# Altium schematic sheet 04 IF AMP Block.SchDoc: <Project Name>
size A3; ApprovedBy: <Appr.>; Author: <Author>; CompanyName: Infineon Technologies AG; Engineer: <Rel.>; Organization: Infineon Technologies AG; Address1: IFAG DES S PS; Address2: Am Campeon 1-12  -  85579 Neubiberg  -  Germany; Address3: 85579 Neubiberg; Address4: Germany; Revision: <Rev.>; SheetNumber: 4; Release: RC00; PageSetup: Record=PageOptions|CenterHorizontal=True|CenterVertical=True|PrintScale=1.01|XCorrection=1.00|YCorrection=1.00|PrintKind=0|BorderSize=5000000|LeftOffset=0|BottomOffset=0|Orientation=2|PaperLength=1000|PaperWidth=1000|Scale=100|PaperSource=7|PrintQuality=-4|MediaType=1|DitherType=10|PaperKind=A3|PrintScaleMode=1; Doc_ConfidentialStatus: <Doc_ConfidentialStatus>; Doc_Preliminary: <Doc_Preliminary>
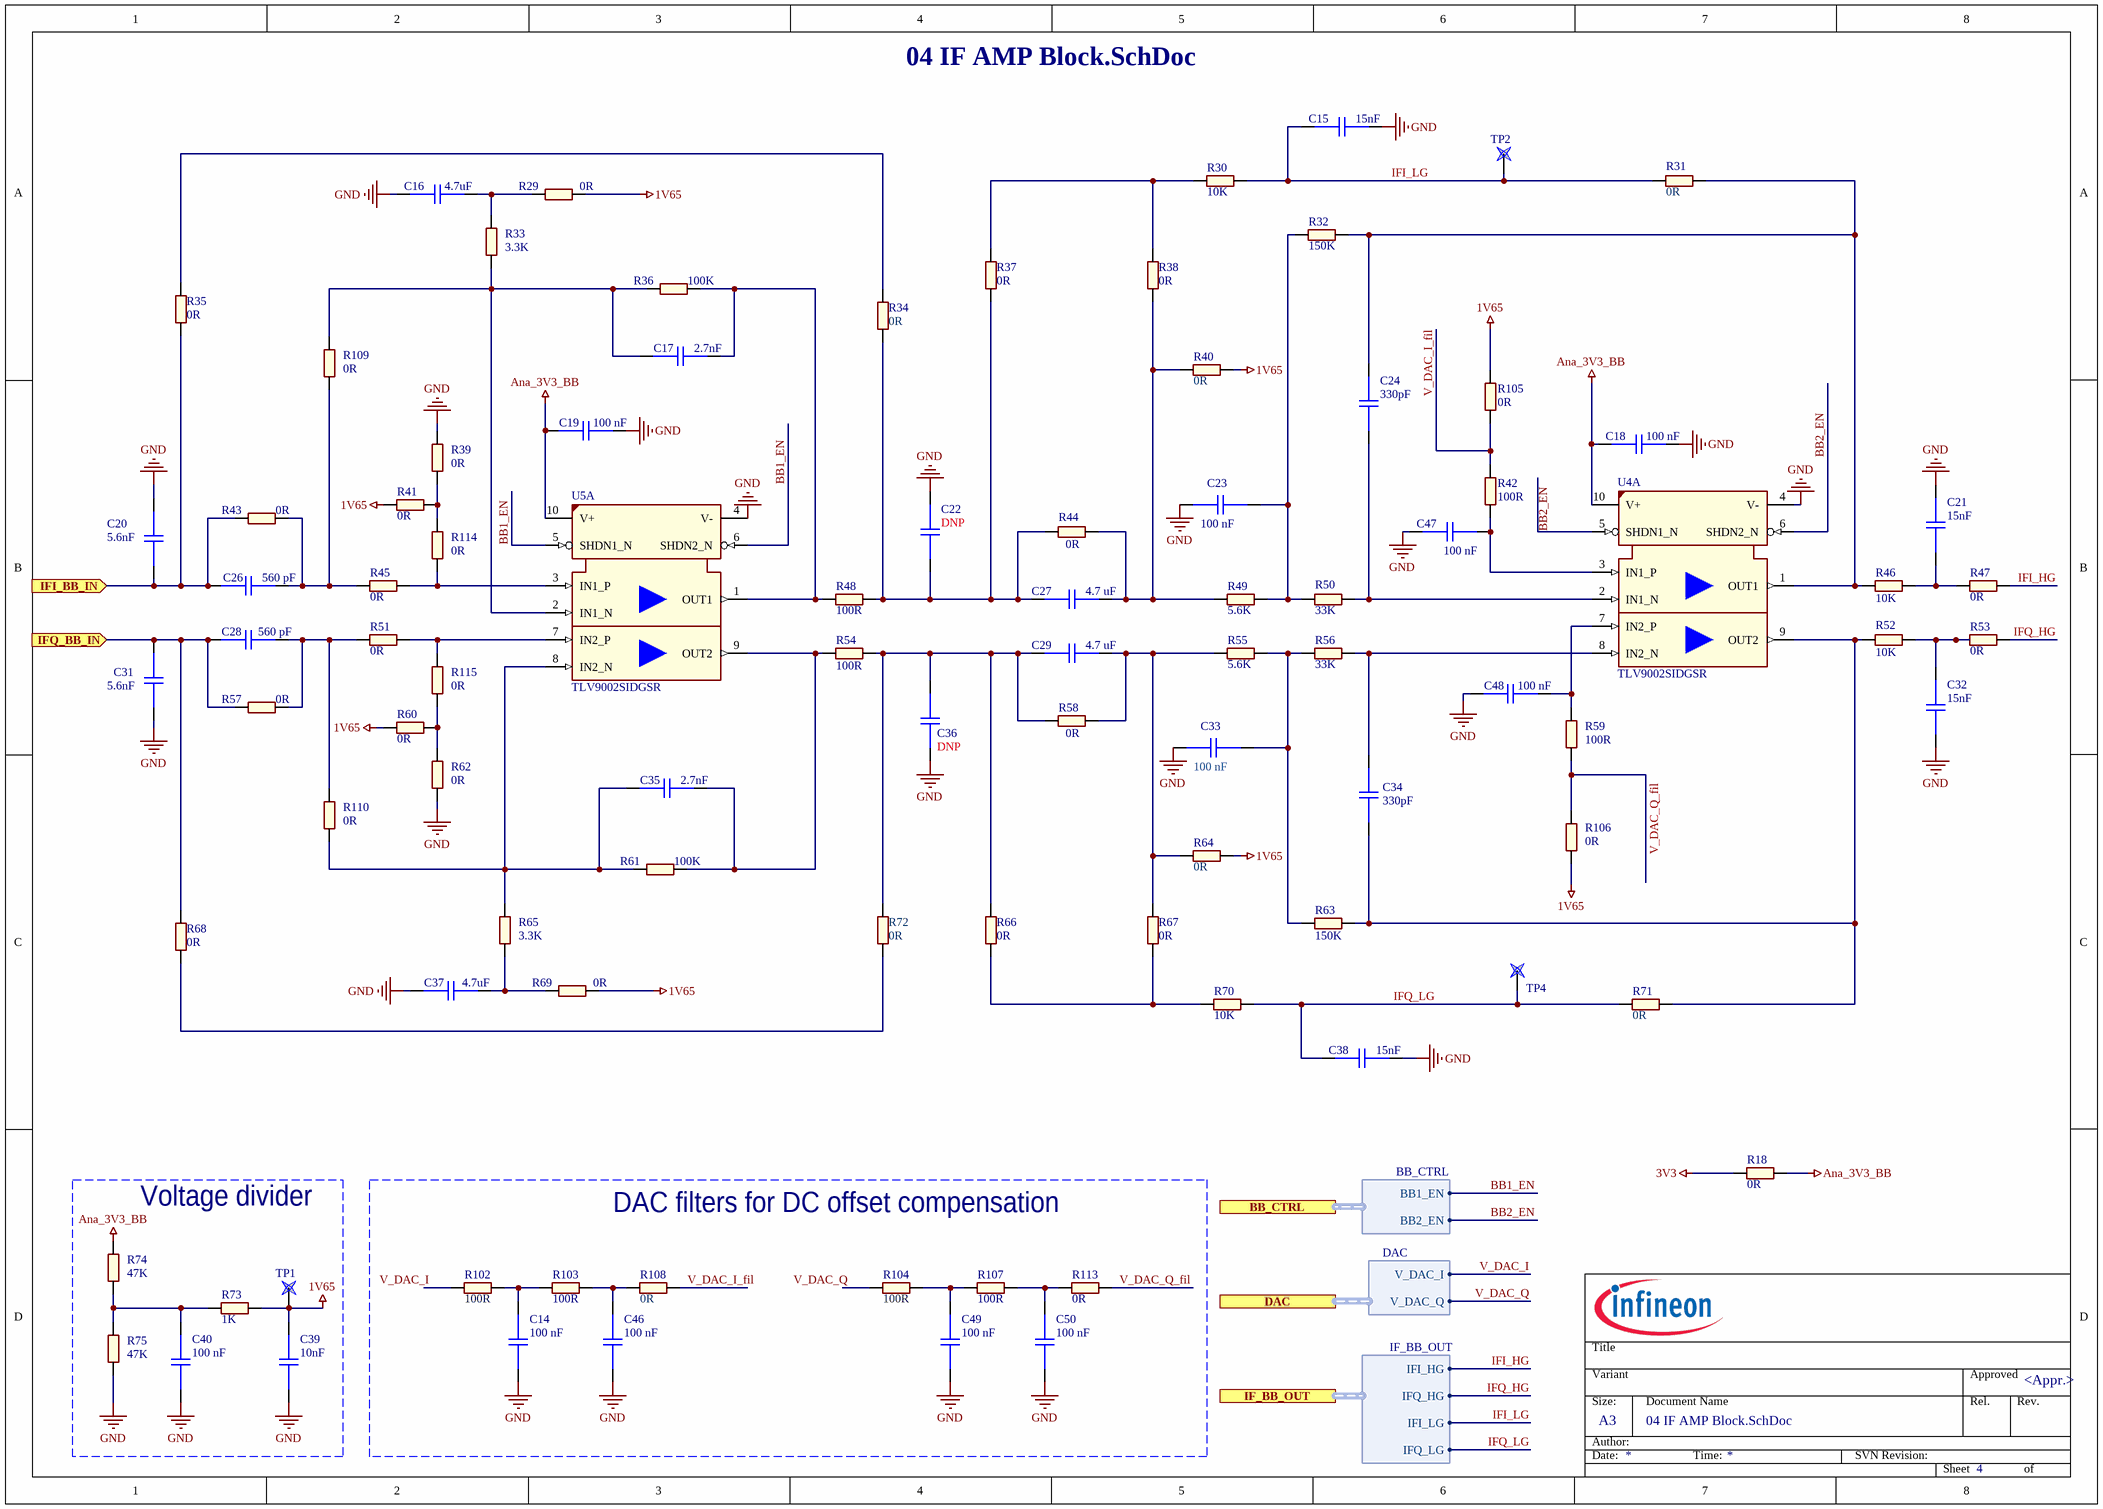
[diagram p0: 04 IF AMP Block.SchDoc]

## Parts
C14  100 nF  [CAPC1005X55N-0_2]
C15  15nF  [CAPC1005X55N-0_2]
C16  4.7uF  [CAPC1005X55N-0_2]
C17  2.7nF  [CAPC1005X55N-0_2]
C18  100 nF  [CAPC1005X55N-0_2]
C19  100 nF  [CAPC1005X55N-0_2]
C20  5.6nF  [CAPC1005X55N-0_2]
C21  15nF  [CAPC1005X55N-0_2]
C22  DNP  [CAPC1005X55N-0_2]
C23  100 nF  [CAPC1005X55N-0_2]
C24  330pF  [CAPC1005X55N-0_2]
C26  560 pF  [CAPC1005X55N-0_2]
C27  4.7 uF  [CAPC1005X55N-0_2]
C28  560 pF  [CAPC1005X55N-0_2]
C29  4.7 uF  [CAPC1005X55N-0_2]
C31  5.6nF  [CAPC1005X55N-0_2]
C32  15nF  [CAPC1005X55N-0_2]
C33  100 nF  [CAPC1005X55N-0_2]
C34  330pF  [CAPC1005X55N-0_2]
C35  2.7nF  [CAPC1005X55N-0_2]
C36  DNP  [CAPC1005X55N-0_2]
C37  4.7uF  [CAPC1005X55N-0_2]
C38  15nF  [CAPC1005X55N-0_2]
C39  10nF  [CAPC1005X55N-0_2]
C40  100 nF  [CAPC1005X55N-0_2]
C46  100 nF  [CAPC1005X55N-0_2]
C47  100 nF  [CAPC1005X55N-0_2]
C48  100 nF  [CAPC1005X55N-0_2]
C49  100 nF  [CAPC1005X55N-0_2]
C50  100 nF  [CAPC1005X55N-0_2]
R18  0R  [RESC1005X40N_2]
R29  0R  [RESC1005X40N_2]
R30  10K  [RESC1005X40N_2]
R31  0R  [RESC1005X40N_2]
R32  150K  [RESC1005X40N_2]
R33  3.3K  [RESC1005X40N_2]
R34  0R  [RESC1005X40N_2]
R35  0R  [RESC1005X40N_2]
R36  100K  [RESC1005X40N_2]
R37  0R  [RESC1005X40N_2]
R38  0R  [RESC1005X40N_2]
R39  0R  [RESC1005X40N_2]
R40  0R  [RESC1005X40N_2]
R41  0R  [RESC1005X40N_2]
R42  100R  [RESC1005X40N_2]
R43  0R  [RESC1005X40N_2]
R44  0R  [RESC1005X40N_2]
R45  0R  [RESC1005X40N_2]
R46  10K  [RESC1005X40N_2]
R47  0R  [RESC1005X40N_2]
R48  100R  [RESC1005X40N_2]
R49  5.6K  [RESC1005X40N_2]
R50  33K  [RESC1005X40N_2]
R51  0R  [RESC1005X40N_2]
R52  10K  [RESC1005X40N_2]
R53  0R  [RESC1005X40N_2]
R54  100R  [RESC1005X40N_2]
R55  5.6K  [RESC1005X40N_2]
R56  33K  [RESC1005X40N_2]
R57  0R  [RESC1005X40N_2]
R58  0R  [RESC1005X40N_2]
R59  100R  [RESC1005X40N_2]
R60  0R  [RESC1005X40N_2]
R61  100K  [RESC1005X40N_2]
R62  0R  [RESC1005X40N_2]
R63  150K  [RESC1005X40N_2]
R64  0R  [RESC1005X40N_2]
R65  3.3K  [RESC1005X40N_2]
R66  0R  [RESC1005X40N_2]
R67  0R  [RESC1005X40N_2]
R68  0R  [RESC1005X40N_2]
R69  0R  [RESC1005X40N_2]
R70  10K  [RESC1005X40N_2]
R71  0R  [RESC1005X40N_2]
R72  0R  [RESC1005X40N_2]
R73  1K  [RESC1005X40N_2]
R74  47K  [RESC1005X40N_2]
R75  47K  [RESC1005X40N_2]
R102  100R  [RESC1005X40N_2]
R103  100R  [RESC1005X40N_2]
R104  100R  [RESC1005X40N_2]
R105  0R  [RESC1005X40N_2]
R106  0R  [RESC1005X40N_2]
R107  100R  [RESC1005X40N_2]
R108  0R  [RESC1005X40N_2]
R109  0R  [RESC1005X40N_2]
R110  0R  [RESC1005X40N_2]
R113  0R  [RESC1005X40N_2]
R114  0R  [RESC1005X40N_2]
R115  0R  [RESC1005X40N_2]
TP1  Testpoint  [TP1.5MM]  (value not drawn)  (no BOM)
TP2  Testpoint  [TP1.5MM]  (value not drawn)  (no BOM)
TP4  Testpoint  [TP1.5MM]  (value not drawn)  (no BOM)
U4  TLV9002SIDGSR  [SOP50P490X110-10N-1-V]  (part A of 3)
U5  TLV9002SIDGSR  [SOP50P490X110-10N-1-V]  (part A of 3)

## Ports
BB_CTRL (harness BB_CTRL), DAC (harness DAC), IF_BB_OUT (harness IF_BB_OUT), IFI_BB_IN (in), IFQ_BB_IN (in)

## Harnesses
IF_BB_OUT: IFI_HG, IFQ_HG, IFQ_LG, IFI_LG
DAC: V_DAC_I, V_DAC_Q
BB_CTRL: BB1_EN, BB2_EN

## Nets
1V65: C39.1 R29.1 R40.1 R41.1 R60.1 R64.1 R69.1 R73.1 R105.2 R106.1 TP1.1
3V3: R18.2
Ana_3V3_BB: C18.2 C19.2 R18.1 R74.2 U4.10(V+) U5.10(V+)
GND: C14.1 C15.2 C16.1 C18.1 C19.1 C20.1 C21.1 C22.1 C23.2 C31.1 C32.2 C33.2 C36.2 C37.2 C38.1 C39.2 C40.2 C46.1 C47.2 C48.1 C49.1 C50.1 R39.2 R62.2 R75.2 U4.4(V-) U5.4(V-)
BB1_EN: U5.5(SHDN1_N) U5.6(SHDN2_N) ; port BB_CTRL.BB1_EN
BB2_EN: U4.5(SHDN1_N) U4.6(SHDN2_N) ; port BB_CTRL.BB2_EN
IFI_BB_IN: C20.2 C26.2 R35.2 R43.2 ; port IFI_BB_IN
IFI_HG: R47.1 ; port IF_BB_OUT.IFI_HG
IFI_LG: C15.1 R30.2 R31.2 TP2.1 ; port IF_BB_OUT.IFI_LG
IFQ_BB_IN: C28.2 C31.2 R57.2 R68.1 ; port IFQ_BB_IN
IFQ_HG: R53.1 ; port IF_BB_OUT.IFQ_HG
IFQ_LG: C38.2 R70.2 R71.2 TP4.1 ; port IF_BB_OUT.IFQ_LG
V_DAC_I: R102.2 ; port DAC.V_DAC_I
V_DAC_I_fil: R42.2 R105.1 R108.1
V_DAC_Q: R104.2 ; port DAC.V_DAC_Q
V_DAC_Q_fil: R59.2 R106.2 R113.1
NetC14_2: C14.2 R102.1 R103.2
NetC16_2: C16.2 R29.2 R33.2
NetC17_1: C17.1 R36.1 R48.2 U5.1(OUT1)
NetC17_2: C17.2 R33.1 R36.2 R109.2 U5.2(IN1_N)
NetC21_2: C21.2 R46.1 R47.2
NetC22_2: C22.2 C27.2 R34.2 R37.1 R44.2 R48.1
NetC23_1: C23.1 R32.2 R49.1 R50.2
NetC24_1: C24.1 R31.1 R32.1 R46.2 U4.1(OUT1)
NetC24_2: C24.2 R50.1 U4.2(IN1_N)
NetC26_1: C26.1 R43.1 R45.2 R109.1
NetC27_1: C27.1 R38.1 R40.2 R44.1 R49.2
NetC28_1: C28.1 R51.2 R57.1 R110.2
NetC29_1: C29.1 R55.2 R58.1 R64.2 R67.2
NetC29_2: C29.2 C36.1 R54.1 R58.2 R66.2 R72.1
NetC32_1: C32.1 R52.1 R53.2
NetC33_1: C33.1 R55.1 R56.2 R63.2
NetC34_1: C34.1 R56.1 U4.8(IN2_N)
NetC34_2: C34.2 R52.2 R63.1 R71.1 U4.9(OUT2)
NetC35_1: C35.1 R54.2 R61.1 U5.9(OUT2)
NetC35_2: C35.2 R61.2 R65.1 R110.1 U5.8(IN2_N)
NetC37_1: C37.1 R65.2 R69.2
NetC40_1: C40.1 R73.2 R74.1 R75.1
NetC46_2: C46.2 R103.1 R108.2
NetC47_1: C47.1 R42.1 U4.3(IN1_P)
NetC48_2: C48.2 R59.1 U4.7(IN2_P)
NetC49_2: C49.2 R104.1 R107.2
NetC50_2: C50.2 R107.1 R113.2
NetR30_1: R30.1 R37.2 R38.2
NetR34_1: R34.1 R35.1
NetR39_1: R39.1 R41.2 R114.1
NetR45_1: R45.1 R114.2 U5.3(IN1_P)
NetR51_1: R51.1 R115.1 U5.7(IN2_P)
NetR60_2: R60.2 R62.1 R115.2
NetR66_1: R66.1 R67.1 R70.1
NetR68_2: R68.2 R72.2

## Notes on the sheet
- Voltage divider
- DAC filters for DC offset compensation
- Title
- Variant
- Approved
- Date:
- Author:
- Size:
- A3
- Document Name
- Time:
- SVN Revision:
- Rel.
- Rev.
- Sheet
- of

## Library data of the parts
C14 C18 C19 C23 C33 C40 C46 C49 C50 = CAP01010597: General Purpose Surface Mount Ceramic Capacitor; Manufacturer: muRata; PartRelease: new; Manufacturer Component Status: Active; ComponentStatus: Released; Voltage: 16Vdc; Tolerance: 2%; TemperaturCharacteristic: C0G; AutomotiveQualified: no; ColibryArticleNumber: 308039; PartNumber: CAP01010597; Value: 100 nF; Type: 100 nF; PackageReference: 0402; PackageDescription: Capacitor,non-polarized,Chip;1.00mm L X 0.50mm W X 0.55mm H; ComponentHeight: 0.55mm; PartType: General Purpose Surface Mount Ceramic Capacitor; ComponentLink1Description: Vendor WebSite; ComponentLink1URL: http://www.murata.com; ComponentLink2Description: Datasheet; ComponentLink2URL: \\MUCSDN31.eu.infineon.com\PCB_Library_Datasheets\GRM1555C1H101GA01.pdf; FixedSupplier: Yes; PartProvision: No; Supplier 1: Farnell; Supplier 2: Digi-Key; Supplier 3: Mouser
C15 C21 C32 C38 = CAP01010597: General Purpose Surface Mount Ceramic Capacitor; Manufacturer: muRata; PartRelease: new; Manufacturer Component Status: Active; ComponentStatus: Released; Type: 15nF/25Vdc; Voltage: 25Vdc; Tolerance: 2%; TemperaturCharacteristic: C0G; AutomotiveQualified: no; ColibryArticleNumber: 308039; PartNumber: CAP01010597; Value: 15nF; PackageReference: 0402; PackageDescription: Capacitor,non-polarized,Chip;1.00mm L X 0.50mm W X 0.55mm H; ComponentHeight: 0.55mm; PartType: General Purpose Surface Mount Ceramic Capacitor; ComponentLink1Description: Vendor WebSite; ComponentLink1URL: http://www.murata.com; ComponentLink2Description: Datasheet; ComponentLink2URL: \\MUCSDN31.eu.infineon.com\PCB_Library_Datasheets\GRM1555C1H101GA01.pdf; FixedSupplier: Yes; PartProvision: No; Supplier 1: Farnell; Supplier 2: Digi-Key; Supplier 3: Mouser
C16 C17 C20 C26-C29 C31 C35 C37 = CAP01010597: General Purpose Surface Mount Ceramic Capacitor; Manufacturer: muRata; PartRelease: new; Manufacturer Component Status: Active; ComponentStatus: Released; Voltage: 50Vdc; Tolerance: 2%; TemperaturCharacteristic: C0G; AutomotiveQualified: no; ColibryArticleNumber: 308039; PartNumber: CAP01010597; PackageReference: 0402; PackageDescription: Capacitor,non-polarized,Chip;1.00mm L X 0.50mm W X 0.55mm H; ComponentHeight: 0.55mm; PartType: General Purpose Surface Mount Ceramic Capacitor; ComponentLink1Description: Vendor WebSite; ComponentLink1URL: http://www.murata.com; ComponentLink2Description: Datasheet; ComponentLink2URL: \\MUCSDN31.eu.infineon.com\PCB_Library_Datasheets\GRM1555C1H101GA01.pdf; FixedSupplier: Yes; PartProvision: No; Supplier 1: Farnell; Supplier 2: Digi-Key; Supplier 3: Mouser
  C16 C37: Value: 4.7uF
  C17 C35: Value: 2.7nF
  C20 C31: Value: 5.6nF
  C26 C28: Value: 560 pF
  C27 C29: Value: 4.7 uF
C22 C36 = CAP01010597: General Purpose Surface Mount Ceramic Capacitor; Manufacturer: muRata; ManufacturerPartNumber: GRM1555C1H101GA01D; PartRelease: new; Manufacturer Component Status: Active; ComponentStatus: Released; Type: 100p/50Vdc; Voltage: 50Vdc; Tolerance: 2%; TemperaturCharacteristic: C0G; AutomotiveQualified: no; ColibryArticleNumber: 308039; PartNumber: CAP01010597; Value: DNP; PackageReference: 0402; PackageDescription: Capacitor,non-polarized,Chip;1.00mm L X 0.50mm W X 0.55mm H; ComponentHeight: 0.55mm; PartType: General Purpose Surface Mount Ceramic Capacitor; ComponentLink1Description: Vendor WebSite; ComponentLink1URL: http://www.murata.com; ComponentLink2Description: Datasheet; ComponentLink2URL: \\MUCSDN31.eu.infineon.com\PCB_Library_Datasheets\GRM1555C1H101GA01.pdf; FixedSupplier: Yes; PartProvision: No; Supplier 1: Farnell; Supplier 2: Digi-Key; Supplier Part Number 2: 490-6188-2-ND; Supplier 3: Mouser; Supplier Part Number 3: 81-GRM1555C1H101GA1D
C24 C34 = CAP01010597: General Purpose Surface Mount Ceramic Capacitor; Manufacturer: muRata; PartRelease: new; Manufacturer Component Status: Active; ComponentStatus: Released; Type: 330pF/50Vdc; Voltage: 50Vdc; Tolerance: 2%; TemperaturCharacteristic: C0G; AutomotiveQualified: no; ColibryArticleNumber: 308039; PartNumber: CAP01010597; Value: 330pF; PackageReference: 0402; PackageDescription: Capacitor,non-polarized,Chip;1.00mm L X 0.50mm W X 0.55mm H; ComponentHeight: 0.55mm; PartType: General Purpose Surface Mount Ceramic Capacitor; ComponentLink1Description: Vendor WebSite; ComponentLink1URL: http://www.murata.com; ComponentLink2Description: Datasheet; ComponentLink2URL: \\MUCSDN31.eu.infineon.com\PCB_Library_Datasheets\GRM1555C1H101GA01.pdf; FixedSupplier: Yes; PartProvision: No; Supplier 1: Farnell; Supplier 2: Digi-Key; Supplier 3: Mouser
C39 = CAP01010597: General Purpose Surface Mount Ceramic Capacitor; Manufacturer: muRata; PartRelease: new; Manufacturer Component Status: Active; ComponentStatus: Released; Type: 10nF/50Vdc; Voltage: 16Vdc; Tolerance: 2%; TemperaturCharacteristic: C0G; AutomotiveQualified: no; ColibryArticleNumber: 308039; PartNumber: CAP01010597; Value: 10nF; PackageReference: 0402; PackageDescription: Capacitor,non-polarized,Chip;1.00mm L X 0.50mm W X 0.55mm H; ComponentHeight: 0.55mm; PartType: General Purpose Surface Mount Ceramic Capacitor; ComponentLink1Description: Vendor WebSite; ComponentLink1URL: http://www.murata.com; ComponentLink2Description: Datasheet; ComponentLink2URL: \\MUCSDN31.eu.infineon.com\PCB_Library_Datasheets\GRM1555C1H101GA01.pdf; FixedSupplier: Yes; PartProvision: No; Supplier 1: Farnell; Supplier 2: Digi-Key; Supplier 3: Mouser
C47 C48 = CAP01010597: General Purpose Surface Mount Ceramic Capacitor; Manufacturer: muRata; ManufacturerPartNumber: GRM1555C1H101GA01D; PartRelease: new; Manufacturer Component Status: Active; ComponentStatus: Released; Voltage: 16Vdc; Tolerance: 2%; TemperaturCharacteristic: C0G; AutomotiveQualified: no; ColibryArticleNumber: 308039; PartNumber: CAP01010597; Value: 100 nF; Type: 100 nF; PackageReference: 0402; PackageDescription: Capacitor,non-polarized,Chip;1.00mm L X 0.50mm W X 0.55mm H; ComponentHeight: 0.55mm; PartType: General Purpose Surface Mount Ceramic Capacitor; ComponentLink1Description: Vendor WebSite; ComponentLink1URL: http://www.murata.com; ComponentLink2Description: Datasheet; ComponentLink2URL: \\MUCSDN31.eu.infineon.com\PCB_Library_Datasheets\GRM1555C1H101GA01.pdf; FixedSupplier: Yes; PartProvision: No; Supplier 1: Farnell; Supplier 2: Digi-Key; Supplier Part Number 2: 490-6188-2-ND; Supplier 3: Mouser; Supplier Part Number 3: 81-GRM1555C1H101GA1D
R18 R29 R31 R34 R35 R39-R41 R43-R45 R47 R51 R53 R57 R58 R60 R62 R64 R68 R69 R71 R72 R105 R106 R109 R110 R114 R115 = RES01800000: 0R/50V/20mOhm; Manufacturer: Vishay; ManufacturerPartNumber: CRCW04020000Z0ED; PartProvision: no; PartRelease: new; Manufacturer Component Status: Active; Symbol Type: Standard Resistor Symbol; Alternate View: yes; ComponentStatus: Released; Power: 1.5A; Voltage: 50V; Tolerance: 20mOhm; AutomotiveQualified: AEC-Q200; ColibryArticleNumber: 339877; PartNumber: RES01800000; Value: 0R; Type: 0R/50V/20mOhm; PartType: Thick Film Chip Resistor; ComponentHeight: 0.4mm; TK: -; ComponentLink1Description: Vendor WebSite; ComponentLink1URL: http://www.vishay.com/; ComponentLink2Description: Datasheet; ComponentLink2URL: \\MUCSDN31.eu.infineon.com\PCB_Library_Datasheets\dcrcwe3.pdf; FixedSupplier: no
  R18 R29 R31 R34 R35 R39-R41 R43-R45 R47 R51 R53 R57 R58 R60 R62 R64 R68 R69 R71 R72 R106 R109 R110 R114 R115: PackageReference: 0402
  R105: PackageReference: 0R
R30 R46 R52 R70 = RES01800000: 10K/50V/20mOhm; Manufacturer: Vishay; PartProvision: no; PartRelease: new; Manufacturer Component Status: Active; Symbol Type: Standard Resistor Symbol; Alternate View: yes; ComponentStatus: Released; Power: 1.5A; Voltage: 50V; Tolerance: 20mOhm; AutomotiveQualified: AEC-Q200; ColibryArticleNumber: 339877; PartNumber: RES01800000; PackageReference: 0402; Value: 10K; Type: 10K/50V/20mOhm; PartType: Thick Film Chip Resistor; ComponentHeight: 0.4mm; TK: -; ComponentLink1Description: Vendor WebSite; ComponentLink1URL: http://www.vishay.com/; ComponentLink2Description: Datasheet; ComponentLink2URL: \\MUCSDN31.eu.infineon.com\PCB_Library_Datasheets\dcrcwe3.pdf; FixedSupplier: no
R32 R63 = RES01800000: 150K/50V/20mOhm; Manufacturer: Vishay; PartProvision: no; PartRelease: new; Manufacturer Component Status: Active; Symbol Type: Standard Resistor Symbol; Alternate View: yes; ComponentStatus: Released; Power: 1.5A; Voltage: 50V; Tolerance: 20mOhm; AutomotiveQualified: AEC-Q200; ColibryArticleNumber: 339877; PartNumber: RES01800000; PackageReference: 0402; Value: 150K; Type: 150K/50V/20mOhm; PartType: Thick Film Chip Resistor; ComponentHeight: 0.4mm; TK: -; ComponentLink1Description: Vendor WebSite; ComponentLink1URL: http://www.vishay.com/; ComponentLink2Description: Datasheet; ComponentLink2URL: \\MUCSDN31.eu.infineon.com\PCB_Library_Datasheets\dcrcwe3.pdf; FixedSupplier: no
R33 R65 = RES01800000: 3.3K/50V/20mOhm; Manufacturer: Vishay; ManufacturerPartNumber: CRCW04020000Z0ED; PartProvision: no; PartRelease: new; Manufacturer Component Status: Active; Symbol Type: Standard Resistor Symbol; Alternate View: yes; ComponentStatus: Released; Power: 1.5A; Voltage: 50V; Tolerance: 20mOhm; AutomotiveQualified: AEC-Q200; ColibryArticleNumber: 339877; PartNumber: RES01800000; PackageReference: 0402; Value: 3.3K; Type: 3.3K/50V/20mOhm; PartType: Thick Film Chip Resistor; ComponentHeight: 0.4mm; TK: -; ComponentLink1Description: Vendor WebSite; ComponentLink1URL: http://www.vishay.com/; ComponentLink2Description: Datasheet; ComponentLink2URL: \\MUCSDN31.eu.infineon.com\PCB_Library_Datasheets\dcrcwe3.pdf; FixedSupplier: no
R36 R61 = RES01800000: 100K/50V/0402; Manufacturer: Vishay; PartProvision: no; PartRelease: new; Manufacturer Component Status: Active; Symbol Type: Standard Resistor Symbol; Alternate View: yes; ComponentStatus: Released; Power: 1.5A; Voltage: 50V; Tolerance: 20mOhm; AutomotiveQualified: AEC-Q200; ColibryArticleNumber: 339877; PartNumber: RES01800000; PackageReference: 0402; Value: 100K; Type: 100K/50V/20mOhm; PartType: Thick Film Chip Resistor; ComponentHeight: 0.4mm; TK: -; ComponentLink1Description: Vendor WebSite; ComponentLink1URL: http://www.vishay.com/; ComponentLink2Description: Datasheet; ComponentLink2URL: \\MUCSDN31.eu.infineon.com\PCB_Library_Datasheets\dcrcwe3.pdf; FixedSupplier: no
R37 R38 R66 R67 R108 R113 = RES01800000: 0R/50V/20mOhm; Manufacturer: Vishay; PartProvision: no; PartRelease: new; Manufacturer Component Status: Active; Symbol Type: Standard Resistor Symbol; Alternate View: yes; ComponentStatus: Released; Power: 1.5A; Voltage: 50V; Tolerance: 20mOhm; AutomotiveQualified: AEC-Q200; ColibryArticleNumber: 339877; PartNumber: RES01800000; PackageReference: 0402; Value: 0R; Type: 0R/50V/20mOhm; PartType: Thick Film Chip Resistor; ComponentHeight: 0.4mm; TK: -; ComponentLink1Description: Vendor WebSite; ComponentLink1URL: http://www.vishay.com/; ComponentLink2Description: Datasheet; ComponentLink2URL: \\MUCSDN31.eu.infineon.com\PCB_Library_Datasheets\dcrcwe3.pdf; FixedSupplier: no
R42 R48 R54 R59 R102-R104 R107 = RES01800000: 100R/50V/0402; Manufacturer: Vishay; PartProvision: no; PartRelease: new; Manufacturer Component Status: Active; Symbol Type: Standard Resistor Symbol; Alternate View: yes; ComponentStatus: Released; Power: 1.5A; Voltage: 50V; Tolerance: 20mOhm; AutomotiveQualified: AEC-Q200; ColibryArticleNumber: 339877; PartNumber: RES01800000; PackageReference: 0402; Value: 100R; Type: 100R/50V/0402; PartType: Thick Film Chip Resistor; ComponentHeight: 0.4mm; TK: -; ComponentLink1Description: Vendor WebSite; ComponentLink1URL: http://www.vishay.com/; ComponentLink2Description: Datasheet; ComponentLink2URL: \\MUCSDN31.eu.infineon.com\PCB_Library_Datasheets\dcrcwe3.pdf; FixedSupplier: no
R49 R55 = RES01800000: 5.6K/50V/20mOhm; Manufacturer: Vishay; ManufacturerPartNumber: CRCW04020000Z0ED; PartProvision: no; PartRelease: new; Manufacturer Component Status: Active; Symbol Type: Standard Resistor Symbol; Alternate View: yes; ComponentStatus: Released; Power: 1.5A; Voltage: 50V; Tolerance: 20mOhm; AutomotiveQualified: AEC-Q200; ColibryArticleNumber: 339877; PartNumber: RES01800000; PackageReference: 0402; Value: 5.6K; Type: 5.6K/50V/20mOhm; PartType: Thick Film Chip Resistor; ComponentHeight: 0.4mm; TK: -; ComponentLink1Description: Vendor WebSite; ComponentLink1URL: http://www.vishay.com/; ComponentLink2Description: Datasheet; ComponentLink2URL: \\MUCSDN31.eu.infineon.com\PCB_Library_Datasheets\dcrcwe3.pdf; FixedSupplier: no
R50 R56 = RES01800000: 5.6K/50V/20mOhm; Manufacturer: Vishay; PartProvision: no; PartRelease: new; Manufacturer Component Status: Active; Symbol Type: Standard Resistor Symbol; Alternate View: yes; ComponentStatus: Released; Power: 1.5A; Voltage: 50V; Tolerance: 20mOhm; AutomotiveQualified: AEC-Q200; ColibryArticleNumber: 339877; PartNumber: RES01800000; PackageReference: 0402; Value: 33K; PartType: Thick Film Chip Resistor; ComponentHeight: 0.4mm; TK: -; ComponentLink1Description: Vendor WebSite; ComponentLink1URL: http://www.vishay.com/; ComponentLink2Description: Datasheet; ComponentLink2URL: \\MUCSDN31.eu.infineon.com\PCB_Library_Datasheets\dcrcwe3.pdf; FixedSupplier: no
R73 = RES01800000: 1K/50V/20mOhm; Manufacturer: Vishay; PartProvision: no; PartRelease: new; Manufacturer Component Status: Active; Symbol Type: Standard Resistor Symbol; Alternate View: yes; ComponentStatus: Released; Power: 1.5A; Voltage: 50V; Tolerance: 20mOhm; AutomotiveQualified: AEC-Q200; ColibryArticleNumber: 339877; PartNumber: RES01800000; PackageReference: 0402; Value: 1K; Type: 1K/50V/20mOhm; PartType: Thick Film Chip Resistor; ComponentHeight: 0.4mm; TK: -; ComponentLink1Description: Vendor WebSite; ComponentLink1URL: http://www.vishay.com/; ComponentLink2Description: Datasheet; ComponentLink2URL: \\MUCSDN31.eu.infineon.com\PCB_Library_Datasheets\dcrcwe3.pdf; FixedSupplier: no
R74 R75 = RES01800000: 47K/50V/20mOhm; Manufacturer: Vishay; PartProvision: no; PartRelease: new; Manufacturer Component Status: Active; Symbol Type: Standard Resistor Symbol; Alternate View: yes; ComponentStatus: Released; Power: 1.5A; Voltage: 50V; Tolerance: 20mOhm; AutomotiveQualified: AEC-Q200; ColibryArticleNumber: 339877; PartNumber: RES01800000; PackageReference: 0402; Value: 47K; Type: 47K/50V/20mOhm; PartType: Thick Film Chip Resistor; ComponentHeight: 0.4mm; TK: -; ComponentLink1Description: Vendor WebSite; ComponentLink1URL: http://www.vishay.com/; ComponentLink2Description: Datasheet; ComponentLink2URL: \\MUCSDN31.eu.infineon.com\PCB_Library_Datasheets\dcrcwe3.pdf; FixedSupplier: no
TP1 TP2 TP4 = P_PRUEFPAD: FootprintBOM: Testpoint; Preis: -
U4 U5 = 600799: Op Amp Dual Low Power Amplifier R-R I/O Â±2.75V/5.5V; Manufacturer: Texas Instruments; Alternate View: Yes; Symbol Type: Low-Power, RRIO, 1-MHz Operational Amplifier for Cost-Sensitive Systems; Article Number: 600799; Version Number: V01; Legacy DeviceID: TI_TLV9002SIDGSR; Combined Parameters: Res.:-;Fmax:-; QuickPick: Amplifier / VSSOP-10 (DGS); Automotive Qualified: No; PLMStatus: Active; Voltage DC (max): na; Multiple Parts: Yes; Part Type: Analog Parts; Manufacturer Order Number: TLV9002SIDGSR; Value: TLV9002SIDGSR; Type: Amplifier; Application: Power Electronics; Temperature min: -40; Temperature max: 125; Temperature Range: Automotive; ROHS Compliant: Y; PackageReference: VSSOP-10 (DGS); ComponentLink1Description: Vendor WebSite; ComponentLink1URL: http://www.ti.com; ComponentLink2Description: Datasheet; ComponentLink2URL: http://webnetprod.muc.infineon.com/PCBPortal_Prod/WorkFlows/AltiumComponent/StandardDocumentation?Versionid=600800; Supplier 1: Farnell; Supplier 2: DigiKey; Supplier Part Number 2: 296-53198-1-ND; Supplier 3: Mouser; Supplier Part Number 3: 595-TLV9002SIDGSR; Second Source allowed: Yes; Package Description: SOP,0.50mm pitch;10 pin,3.00mm W X 3.00mm L X 1.10mm H body